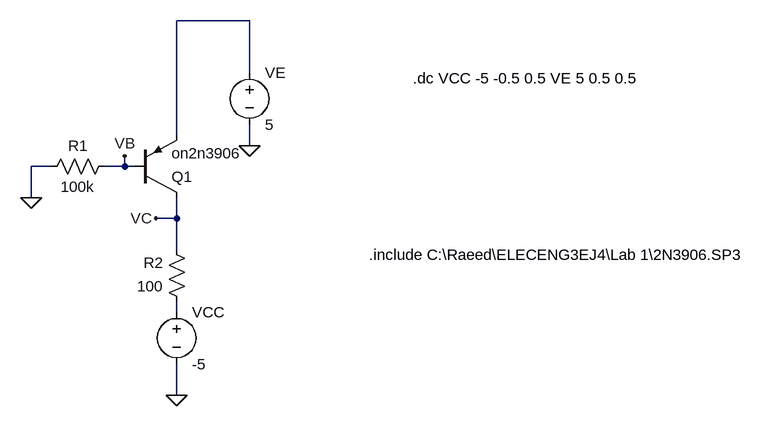
[diagram p0: schematic Part2.asc]
Part2.asc, the LTspice schematic file:
Version 4
SHEET 1 1200 680
WIRE 400 -128 288 -128
WIRE 400 -48 400 -128
WIRE 288 48 288 -128
WIRE 400 64 400 32
WIRE 96 96 64 96
WIRE 208 96 208 80
WIRE 208 96 176 96
WIRE 224 96 208 96
WIRE 64 144 64 96
WIRE 288 176 288 144
WIRE 288 176 256 176
WIRE 288 224 288 176
WIRE 288 320 288 304
WIRE 288 448 288 400
FLAG 400 64 0
FLAG 288 448 0
FLAG 64 144 0
FLAG 256 176 VC
FLAG 208 80 VB
SYMBOL res 192 80 R90
WINDOW 0 0 56 VBottom 2
WINDOW 3 32 56 VTop 2
SYMATTR InstName R1
SYMATTR Value 100k
SYMBOL res 304 320 R180
WINDOW 0 36 76 Left 2
WINDOW 3 36 40 Left 2
SYMATTR InstName R2
SYMATTR Value 100
SYMBOL voltage 288 304 R0
SYMATTR InstName VCC
SYMATTR Value -5
SYMBOL voltage 400 -64 R0
SYMATTR InstName VE
SYMATTR Value 5
SYMBOL pnp 224 144 M180
SYMATTR InstName Q1
SYMATTR Value on2n3906
TEXT 652 -40 Left 2 !.dc VCC -5 -0.5 0.5 VE 5 0.5 0.5
TEXT 584 232 Left 2 !.include C:\\Raeed\\ELECENG3EJ4\\Lab 1\\2N3906.SP3

The netlist it stands for:
* Part2.asc
R1 VB 0 100k
R2 N002 VC 100
VCC N002 0 -5
VE N001 0 5
Q1 VC VB N001 0 on2n3906
.model NPN NPN
.model PNP PNP
.lib standard.bjt
.dc VCC -5 -0.5 0.5 VE 5 0.5 0.5
.include C:\Raeed\ELECENG3EJ4\Lab 1\2N3906.SP3
.backanno
.end